# EAGLE design tarocco (EAGLE 8.0.0)
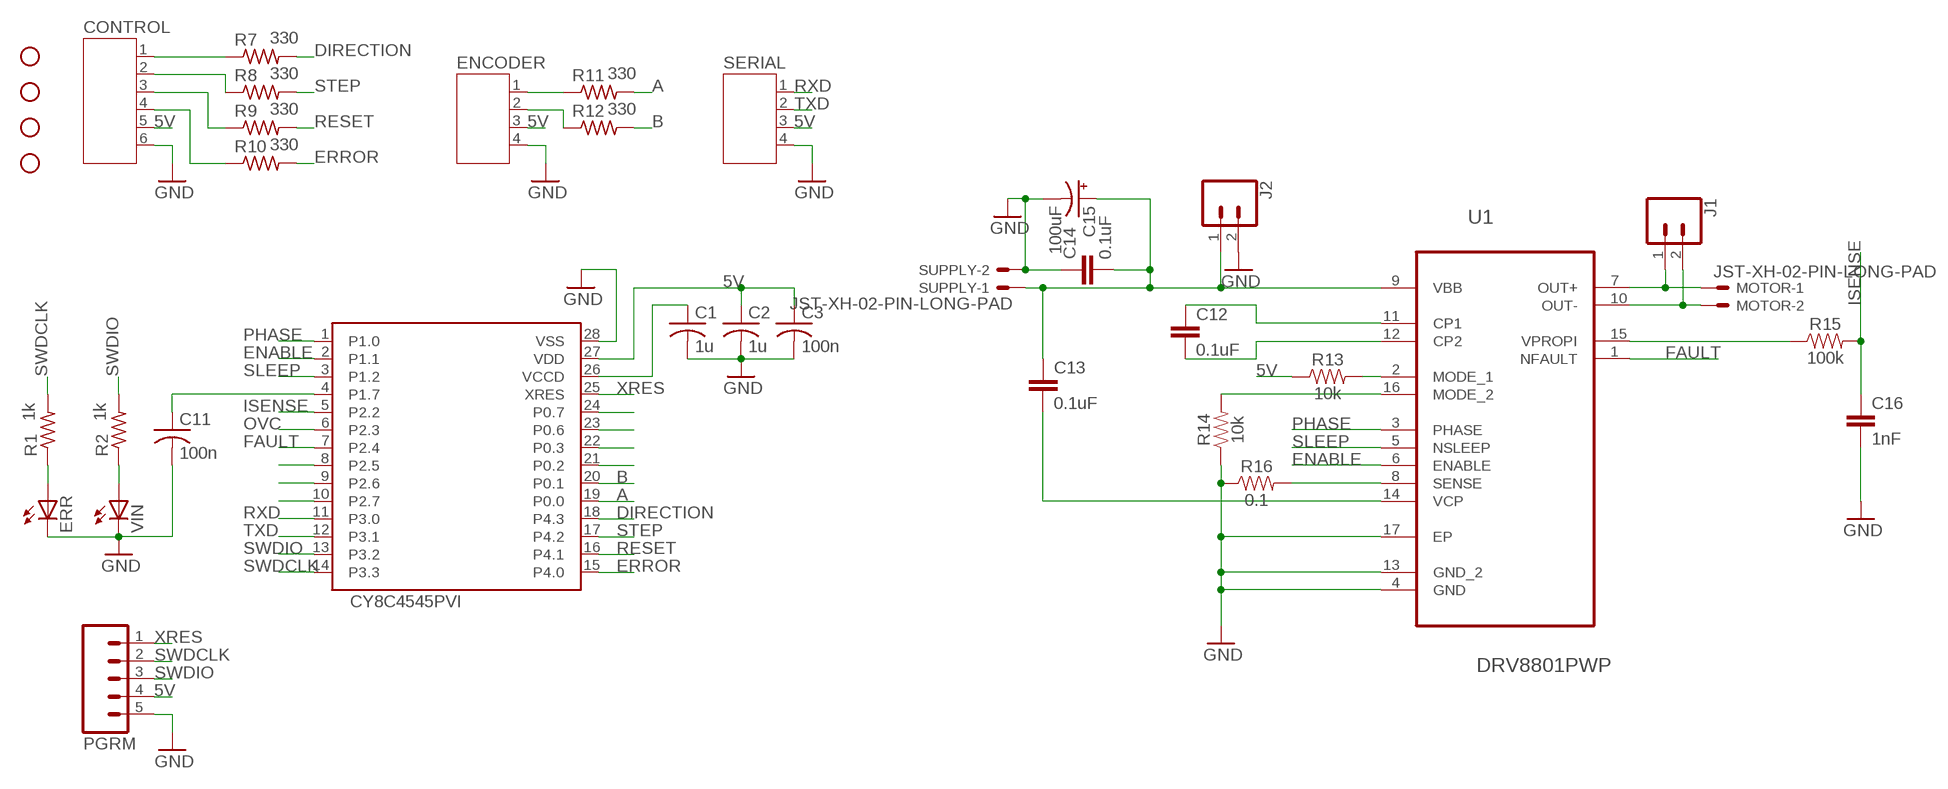
[diagram p0: schematic, sheet 1]

## Parts
C1  1u  C-USC0603  [C0603]
C2  1u  C-USC0603  [C0603]
C3  100n  C-USC0603  [C0603]
C11  100n  C-USC0603  [C0603]
C12  0.1uF  0.1UF-0603-100V-10%  [0603]
C13  0.1uF  0.1UF-0603-25V-(+80/-20%)  [0603]
C14  0.1uF  0.1UF-0603-25V-(+80/-20%)  [0603]
C15  100uF  100UF-POLAR-RADIAL-2.5MM-25V-20%  [CPOL-RADIAL-2.5MM-6.5MM]
C16  1nF  1.0NF/1000PF-0603-50V-10%  [0603]
CONTROL  JST-PH6  [JST-PH6]
ENCODER  JST-PH4  [JST-PH4]
ERR  LEDCHIP-LED0603  [CHIP-LED0603]
IC1  CY8C4545PVI  [SSOP28]
J1  CONN_02PTH3  [1X02_LONGPADS]
J2  CONN_02PTH3  [1X02_LONGPADS]
MOTOR  JST-XH-02-PIN-LONG-PAD  [JST-XH-02-PACKAGE-LONG-PAD]
PGRM  M05SMD2  [1X05-1MM-RA]
R1  1k  R-US_R0603  [R0603]
R2  1k  R-US_R0603  [R0603]
R7  330  R-US_R0603  [R0603]
R8  330  R-US_R0603  [R0603]
R9  330  R-US_R0603  [R0603]
R10  330  R-US_R0603  [R0603]
R11  330  R-US_R0603  [R0603]
R12  330  R-US_R0603  [R0603]
R13  10k  10KOHM-0603-1/10W-1%  [0603]
R14  10k  10KOHM-0603-1/10W-1%  [0603]
R15  100k  100KOHM-0603-1/10W-1%  [0603]
R16  0.1  0.1OHM-1210-1/2W-1%  [1210]
SERIAL  JST-PH4  [JST-PH4]
STANDOFF1  STAND-OFF  [STAND-OFF]
STANDOFF2  STAND-OFF  [STAND-OFF]
STANDOFF3  STAND-OFF  [STAND-OFF]
STANDOFF4  STAND-OFF  [STAND-OFF]
SUPPLY  JST-XH-02-PIN-LONG-PAD  [JST-XH-02-PACKAGE-LONG-PAD]
U1  DRV8801PWP  [SOP65P640X120-17N]
VIN  LEDCHIP-LED0603  [CHIP-LED0603]

## Nets
5V: C2.1 C3.1 CONTROL.5 ENCODER.3 IC1.27(VDD) PGRM.4 R13.1 SERIAL.3
A: IC1.19(P0.0) R11.2
B: IC1.20(P0.1) R12.2
DIRECTION: IC1.18(P4.3) R7.2
ENABLE: IC1.2(P1.1) U1.6(ENABLE)
ERROR: IC1.15(P4.0) R10.2
FAULT: IC1.7(P2.4) U1.1(NFAULT)
GND: C1.2 C2.2 C3.2 C11.2 C14.1 C15.2(-) C16.2 CONTROL.6 ENCODER.4 ERR.C IC1.28(VSS) J2.2 PGRM.5 R14.1 R16.1 SERIAL.4 SUPPLY.2 U1.4(GND) U1.13(GND_2) U1.17(EP) VIN.C
ISENSE: C16.1 IC1.5(P2.2) R15.2
N$8: ENCODER.1 R11.1
N$9: R13.2 U1.2(MODE_1)
N$10: ENCODER.2 R12.1
N$14: CONTROL.1 R7.1
N$18: CONTROL.2 R8.1
N$19: C1.1 IC1.26(VCCD)
N$20: CONTROL.3 R9.1
N$22: CONTROL.4 R10.1
N$24: ERR.A R1.1
N$25: R2.1 VIN.A
N$26: C13.1 C14.2 C15.1(+) J2.1 SUPPLY.1 U1.9(VBB)
N$27: R15.1 U1.15(VPROPI)
N$28: C12.1 U1.11(CP1)
N$29: C11.1 IC1.4(P1.7)
N$30: C12.2 U1.12(CP2)
N$31: C13.2 U1.14(VCP)
N$32: R14.2 U1.16(MODE_2)
N$33: IC1.8(P2.5)
N$34: IC1.9(P2.6)
N$35: IC1.10(P2.7)
N$36: R16.2 U1.8(SENSE)
N$46: IC1.21(P0.2)
N$47: IC1.22(P0.3)
N$48: IC1.23(P0.6)
N$49: IC1.24(P0.7)
OVC: IC1.6(P2.3)
PHASE: IC1.1(P1.0) U1.3(PHASE)
RESET: IC1.16(P4.1) R9.2
RXD: IC1.11(P3.0) SERIAL.1
SLEEP: IC1.3(P1.2) U1.5(NSLEEP)
STEP: IC1.17(P4.2) R8.2
SWDCLK: IC1.14(P3.3) PGRM.2 R1.2
SWDIO: IC1.13(P3.2) PGRM.3 R2.2
TXD: IC1.12(P3.1) SERIAL.2
VMOT+: J1.1 MOTOR.1 U1.7(OUT+)
VMOT-: J1.2 MOTOR.2 U1.10(OUT-)
XRES: IC1.25(XRES) PGRM.1

## Library data of the parts
C1-C3 C11 = adafruit:C-US: CAPACITOR, American symbol
C12 = SparkFun-Capacitors:0.1UF: 0.1µF ceramic capacitors A capacitor is a passive two-terminal electrical component used to store electrical energy temporarily in an electric field.; PROD_ID: CAP-08390
C13 C14 = SparkFun-Capacitors:0.1UF: 0.1µF ceramic capacitors A capacitor is a passive two-terminal electrical component used to store electrical energy temporarily in an electric field.; PROD_ID: CAP-00810
C15 = SparkFun-Capacitors:100UF-POLAR: 100µF polarized capacitors A capacitor is a passive two-terminal electrical component used to store electrical energy temporarily in an electric field.; PROD_ID: CAP-08439
C16 = SparkFun-Capacitors:1.0NF/1000PF: 1nF/1,000pF ceramic capacitors A capacitor is a passive two-terminal electrical component used to store electrical energy temporarily in an electric field.; PROD_ID: CAP-07886
CONTROL = jst-ph:JST-PH6
ENCODER SERIAL = jst-ph:JST-PH4
ERR VIN = adafruit:LED: LED OSRAM: - CHIPLED LG R971, LG N971, LY N971, LG Q971, LY Q971, LO R971, LY R971 LH N974, LH R974 LS Q976, LO Q976, LY Q976 LO Q996 - Hyper CHIPLED LW Q18S LB Q993, LB Q99A, LB R99A - SideLED LS A670, LO A670, LY A670, LG A670, LP A670 LB A673, LV A673, LT A673, LW A673 LH A674 LY A675 LS A676, LA A676, LO A676, LY A676, LW A676 LS A679, LY A679, LG A679 - Hyper Micro SIDELED® LS Y876, LA Y876, LO Y876, LY Y876 LT Y87S - SmartLED LW L88C, LW L88S LB L89C, LB L89S, LG L890 LS L89K, LO L89K, LY L89K LS L896, LA L896, LO L896, LY L896 - TOPLED LS T670, LO T670, LY T670, LG T670, LP T670 LSG T670, LSP T670, LSY T670, LOP T670, LYG T670 LG T671, LOG T671, LSG T671 LB T673, LV T673, LT T673, LW T673 LH T674 LS T676, LA T676, LO T676, LY T676, LB T676, LH T676, LSB T676, LW T676 LB T67C, LV T67C, LT T67C, LS T67K, LO T67K, LY T67K, LW E67C LS E67B, LA E67B, LO E67B, LY E67B, LB E67C, LV E67C, LT E67C LW T67C LS T679, LY T679, LG T679 LS T770, LO T770, LY T770, LG T770, LP T770 LB T773, LV T773, LT T773, LW T773 LH T774 LS E675, LA E675, LY E675, LS T675 LS T776, LA T776, LO T776, LY T776, LB T776 LHGB T686 LT T68C, LB T68C - Hyper Mini TOPLED® LB M676 - Mini TOPLED Santana® LG M470 LS M47K, LO M47K, LY M47K Source: http://www.osram.convergy.de/
IC1 = CY8C4200:CY8C4545PVI: CY8C4245 SSOP-28
J1 J2 = SparkFun-Connectors:CONN_02: Multi connection point. Often used as Generic Header-pin footprint for 0.1 inch spaced/style header connections On any of the 0.1 inch spaced packages, you can populate with these: Break Away Headers - Straight <https://www.sparkfun.com/products/116> (PRT-00116) Break Away Male Headers - Right Angle <https://www.sparkfun.com/products/553> (PRT-00553) Female Headers <https://www.sparkfun.com/products/115> (PRT-00115) Break Away Headers - Machine Pin <https://www.sparkfun.com/products/117> (PRT-00117) Break Away Female Headers - Swiss Machine Pin <https://www.sparkfun.com/products/743> (PRT-00743) For SCREWTERMINALS and SPRING TERMINALS visit here: Screw Terimnals on SparkFun.com <https://www.sparkfun.com/search/results?term=Screw+Terminals> (5mm/3.5mm/2.54mm spacing) This device is also useful as a general connection point to wire up your design to another part of your project. Our various solder wires solder well into these plated through hole pads. Hook-Up Wire - Assortment (Stranded, 22 AWG) <https://www.sparkfun.com/products/11375> (PRT-11375) Hook-Up Wire - Assortment (Solid Core, 22 AWG) <https://www.sparkfun.com/products/11367> (PRT-11367) View the entire wire category on our website here <https://www.sparkfun.com/categories/141> Special notes: Molex polarized connector foot print use with: PRT-08233 with associated crimp pins and housings. 2.54_SCREWTERM for use with PRT-10571. 3.5mm Screw Terminal footprints for PRT-08084 5mm Screw Terminal footprints for use with PRT-08432
MOTOR SUPPLY = JST XH Connectors v1-0:JST-XH-02-PIN: JST XH Connector 2 Pin Wire to board connector. Pitch: 2,54 mm, (0.100") Number of pins: 2 Created by Rembrandt Electronics www.rembrandtelectronics.com
PGRM = SparkFun-Connectors:M05: Header 5 Standard 5-pin 0.1" header. Use with straight break away headers (SKU : PRT-00116), right angle break away headers (PRT-00553), swiss pins (PRT-00743), machine pins (PRT-00117), and female headers (PRT-00115). Molex polarized connector foot print use with SKU : PRT-08230 with associated crimp pins and housings.
R1 R2 R7-R12 = adafruit:R-US_: RESISTOR, American symbol
R13 R14 = SparkFun-Resistors:10KOHM: 10kΩ resistor A resistor is a passive two-terminal electrical component that implements electrical resistance as a circuit element. Resistors act to reduce current flow, and, at the same time, act to lower voltage levels within circuits. - Wikipedia; PROD_ID: RES-00824
R15 = SparkFun-Resistors:100KOHM: 100kΩ resistor A resistor is a passive two-terminal electrical component that implements electrical resistance as a circuit element. Resistors act to reduce current flow, and, at the same time, act to lower voltage levels within circuits. - Wikipedia; PROD_ID: RES-07828
R16 = SparkFun-Resistors:0.1OHM: 0.1Ω resistor A resistor is a passive two-terminal electrical component that implements electrical resistance as a circuit element. Resistors act to reduce current flow, and, at the same time, act to lower voltage levels within circuits. - Wikipedia; PROD_ID: RES-12374
STANDOFF1-STANDOFF4 = SparkFun-Electromechanical:STAND-OFF: #4 Stand Off This is the mechanical footprint for a #4 phillips button head screw. Use the keepout ring to avoid running the screw head into surrounding components. SKU : PRT-00447
U1 = DRV8801PWP:DRV8801PWP: DMOS FULL-BRIDGE MOTOR DRIVERS; AVAILABILITY: Good; DESCRIPTION: 2.8A Brushed DC Motor Driver with Current Sense (PH/EN Ctrl) 16-HTSSOP -40 to 85; MF: Texas Instruments; MP: DRV8801PWP; PACKAGE: HTSSOP-16 Texas Instruments; PRICE: 2.38 USD

## Board
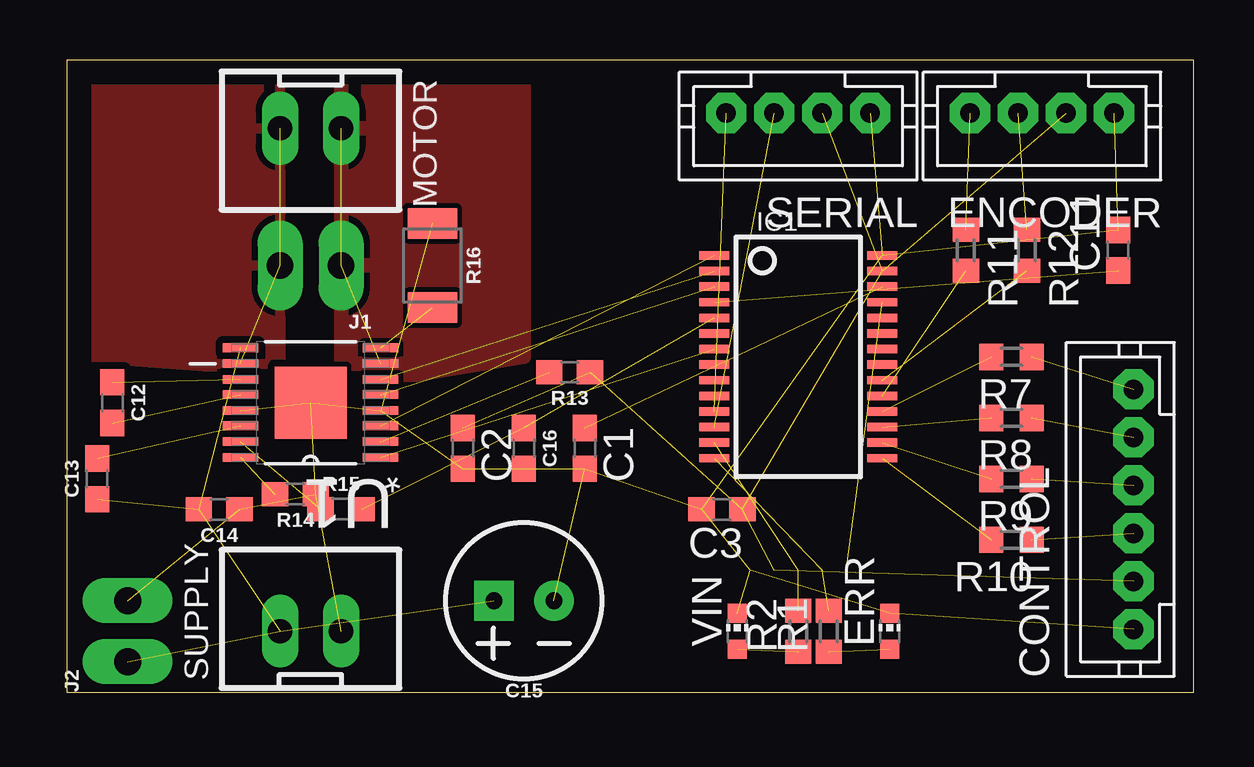
[diagram p1: board, top side]
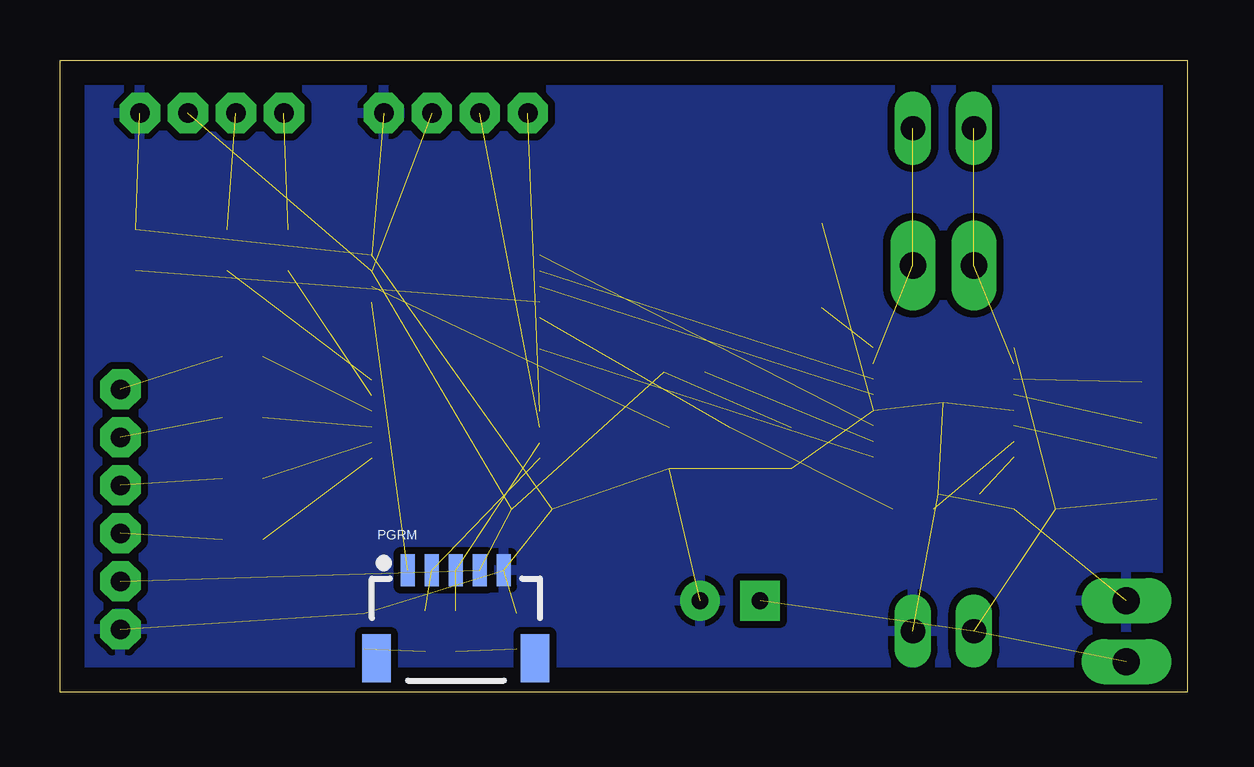
[diagram p2: board, bottom side, seen from below]

Size 46.97 x 26.34 mm. Coordinates in mm from the lower left corner, seen from the top.
Outline: 0,0 46.97,0 46.97,26.34 0,26.34 0,0
Copper layers (1*16): Top 0.035mm / dielectric 1.5mm / Bottom 0.035mm
Design rules "default": minimum track width 10mil, minimum drill 24mil, track to track 8mil, track to pad 8mil, pad to pad 8mil, via to via 8mil, smd to smd 8mil, copper to edge 40mil, drill to drill 8mil, minimum pad ring 10mil, minimum via ring 8mil, stop-mask expansion 4mil, vias tented up to drill 0mil, thermal gap 10mil

### Footprints (pad centres in the part's own frame; a part is rotated, then mirrored left to right if it is on the bottom)
C0603 = smd 1.1 x 1: 1 -0.85,0; 2 0.85,0
0603 = smd 1.1 x 1: 1 -0.85,0; 2 0.85,0
CPOL-RADIAL-2.5MM-6.5MM = drill 0.7 pad 1.651 square: 1 1.25,0 | drill 0.7 pad 1.651: 2 -1.25,0
JST-PH6 = drill 0.813 pad 1.676 octagon: 1 5,0; 2 3,0; 3 1,0; 4 -1,0; 5 -3,0; 6 -5,0
JST-PH4 = drill 0.813 pad 1.676 octagon: 1 3,0; 2 1,0; 3 -1,0; 4 -3,0
CHIP-LED0603 = smd 0.8 x 0.8: A 0,-0.75; C 0,0.75
SSOP28 = smd 0.35 x 1.25: 1 -4.225,-3.5; 2 -3.575,-3.5; 3 -2.925,-3.5; 4 -2.275,-3.5; 5 -1.625,-3.5; 6 -0.975,-3.5; 7 -0.325,-3.5; 8 0.325,-3.5; 9 0.975,-3.5; 10 1.625,-3.5; 11 2.275,-3.5; 12 2.925,-3.5; 13 3.575,-3.5; 14 4.225,-3.5; 15 4.225,3.5; 16 3.575,3.5; 17 2.925,3.5; 18 2.275,3.5; 19 1.625,3.5; 20 0.975,3.5; 21 0.325,3.5; 22 -0.325,3.5; 23 -0.975,3.5; 24 -1.625,3.5; 25 -2.275,3.5; 26 -2.925,3.5; 27 -3.575,3.5; 28 -4.225,3.5
1X02_LONGPADS = drill 1.118 pad 1.88 long: 1 0,0; 2 2.54,0
JST-XH-02-PACKAGE-LONG-PAD = drill 1.016 long: 1 -1.27,0; 2 1.27,0
1X05-1MM-RA = smd 0.6 x 1.35: 1 -2,0; 2 -1,0; 3 0,0; 4 1,0; 5 2,0 | smd 1.2 x 2: NC1 3.3,-3.675; NC2 -3.3,-3.675
R0603 = smd 1 x 1.1: 1 -0.85,0; 2 0.85,0
1210 = smd 1.27 x 2.06: 1 -1.755,0; 2 1.755,0
STAND-OFF = hole 3.302: 0,0
SOP65P640X120-17N = smd 1.473 x 0.356: 1 -2.921,2.286; 2 -2.921,1.626; 3 -2.921,0.965; 4 -2.921,0.33; 5 -2.921,-0.33; 6 -2.921,-0.965; 7 -2.921,-1.626; 8 -2.921,-2.286; 9 2.921,-2.286; 10 2.921,-1.626; 11 2.921,-0.965; 12 2.921,-0.33; 13 2.921,0.33; 14 2.921,0.965; 15 2.921,1.626; 16 2.921,2.286 | smd 2.997 x 2.997: 17 0,0

### Placement (x,y rotation side)
C1  21.59,10.16 270 top
C2  16.51,10.16 270 top
C3  27.31,7.62 180 top
C11  43.81,18.41 90 top
C12  1.9,12.06 270 top
C13  1.27,8.89 90 top
C14  6.35,7.62 180 top
C15  19.05,3.81 180 top
C16  19.05,10.16 270 top
CONTROL  44.45,7.62 90 top
ENCODER  40.64,24.13 180 top
ERR  34.29,2.54 0 top
IC1  30.48,13.97 270 top
J1  11.43,17.78 180 top
J2  2.54,1.27 90 top
MOTOR  10.16,23.5 180 top
PGRM  30.48,5.08 0 bottom
R1  31.75,2.54 90 top
R2  30.48,2.54 90 top
R7  39.37,13.97 180 top
R8  39.37,11.43 180 top
R9  39.37,8.89 180 top
R10  39.37,6.35 180 top
R11  37.47,18.41 270 top
R12  40,18.41 270 top
R13  20.95,13.34 180 top
R14  9.52,8.26 180 top
R15  11.43,7.62 0 top
R16  15.24,17.78 270 top
SERIAL  30.48,24.13 180 top
STANDOFF1  -35.56,31.75 0 top  (outside the outline)
STANDOFF2  -41.91,31.75 0 top  (outside the outline)
STANDOFF3  -48.26,31.75 0 top  (outside the outline)
STANDOFF4  -54.61,31.75 0 top  (outside the outline)
SUPPLY  10.16,2.54 0 top
U1  10.16,12.06 180 top
VIN  27.94,2.54 0 top

### Tracks (layer width: path | path; a pad name or v marks a point on that pad's centre or on a via)
5V  (7 unrouted)
A  (1 unrouted)
B  (1 unrouted)
DIRECTION  (1 unrouted)
ENABLE  (1 unrouted)
ERROR  (1 unrouted)
FAULT  (1 unrouted)
GND  (20 unrouted)
  pour Bottom (isolate 0.305): 0,26.42 46.99,26.29 46.99,0 0,0
ISENSE  (2 unrouted)
N$8  (1 unrouted)
N$9  (1 unrouted)
N$10  (1 unrouted)
N$14  (1 unrouted)
N$18  (1 unrouted)
N$19  (1 unrouted)
N$20  (1 unrouted)
N$22  (1 unrouted)
N$24  (1 unrouted)
N$25  (1 unrouted)
N$26  (5 unrouted)
N$27  (1 unrouted)
N$28  (1 unrouted)
N$29  (1 unrouted)
N$30  (1 unrouted)
N$31  (1 unrouted)
N$32  (1 unrouted)
N$36  (1 unrouted)
PHASE  (1 unrouted)
RESET  (1 unrouted)
RXD  (1 unrouted)
SLEEP  (1 unrouted)
STEP  (1 unrouted)
SWDCLK  (2 unrouted)
SWDIO  (2 unrouted)
TXD  (1 unrouted)
VMOT+  (2 unrouted)
  pour Top: 11.43,26.67 19.05,26.67 19.05,13.97 11.43,12.7
VMOT-  (2 unrouted)
  pour Top (isolate 0.305): 0,25.4 8.89,25.4 8.89,13.34 0,13.97
XRES  (1 unrouted)